# EAGLE design LED Strips - Schematic (EAGLE 6.5.0)
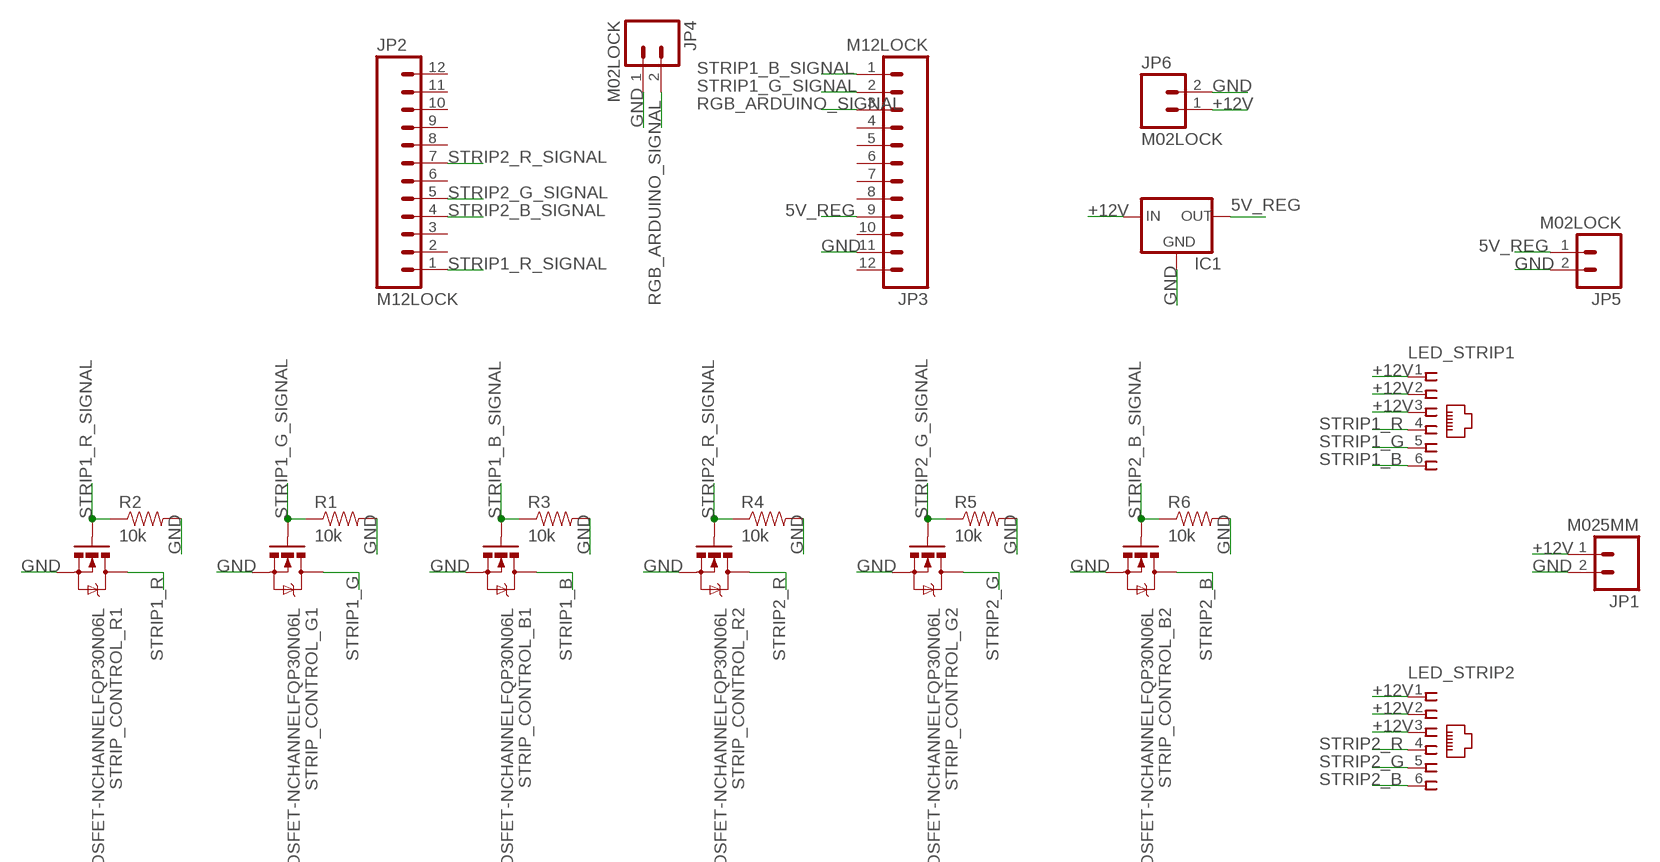
[diagram p0: schematic, sheet 1]

## Parts
IC1  V_REG_78XXSIDE  [78XXL]
JP1  M025MM  [SCREWTERMINAL-5MM-2]
JP2  M12LOCK  [1X12_LOCK]
JP3  M12LOCK  [1X12_LOCK]
JP4  M02LOCK  [1X02_LOCK]
JP5  M02LOCK  [1X02_LOCK]
JP6  M02LOCK  [1X02_LOCK]
LED_STRIP1  555165-1  [555165-1]
LED_STRIP2  555165-1  [555165-1]
R1  10k  RESISTOR0603  [0603-RES]
R2  10k  RESISTOR0603  [0603-RES]
R3  10k  RESISTOR0603  [0603-RES]
R4  10k  RESISTOR0603  [0603-RES]
R5  10k  RESISTOR0603  [0603-RES]
R6  10k  RESISTOR0603  [0603-RES]
STRIP_CONTROL_B1  MOSFET-NCHANNELFQP30N06L  [TO220V]
STRIP_CONTROL_B2  MOSFET-NCHANNELFQP30N06L  [TO220V]
STRIP_CONTROL_G1  MOSFET-NCHANNELFQP30N06L  [TO220V]
STRIP_CONTROL_G2  MOSFET-NCHANNELFQP30N06L  [TO220V]
STRIP_CONTROL_R1  MOSFET-NCHANNELFQP30N06L  [TO220V]
STRIP_CONTROL_R2  MOSFET-NCHANNELFQP30N06L  [TO220V]

## Nets
5V_REG: IC1.OUT JP3.9 JP5.1
+12V: IC1.IN JP1.1 JP6.1 LED_STRIP1.1 LED_STRIP1.2 LED_STRIP1.3 LED_STRIP2.1 LED_STRIP2.2 LED_STRIP2.3
GND: IC1.GND JP1.2 JP3.11 JP4.1 JP5.2 JP6.2 R1.2 R2.2 R3.2 R4.2 R5.2 R6.2 STRIP_CONTROL_B1.3(S) STRIP_CONTROL_B2.3(S) STRIP_CONTROL_G1.3(S) STRIP_CONTROL_G2.3(S) STRIP_CONTROL_R1.3(S) STRIP_CONTROL_R2.3(S)
RGB_ARDUINO_SIGNAL: JP3.3 JP4.2
STRIP1_B: LED_STRIP1.6 STRIP_CONTROL_B1.2(D)
STRIP1_B_SIGNAL: JP3.1 R3.1 STRIP_CONTROL_B1.1(G)
STRIP1_G: LED_STRIP1.5 STRIP_CONTROL_G1.2(D)
STRIP1_G_SIGNAL: JP3.2 R1.1 STRIP_CONTROL_G1.1(G)
STRIP1_R: LED_STRIP1.4 STRIP_CONTROL_R1.2(D)
STRIP1_R_SIGNAL: JP2.1 R2.1 STRIP_CONTROL_R1.1(G)
STRIP2_B: LED_STRIP2.6 STRIP_CONTROL_B2.2(D)
STRIP2_B_SIGNAL: JP2.4 R6.1 STRIP_CONTROL_B2.1(G)
STRIP2_G: LED_STRIP2.5 STRIP_CONTROL_G2.2(D)
STRIP2_G_SIGNAL: JP2.5 R5.1 STRIP_CONTROL_G2.1(G)
STRIP2_R: LED_STRIP2.4 STRIP_CONTROL_R2.2(D)
STRIP2_R_SIGNAL: JP2.7 R4.1 STRIP_CONTROL_R2.1(G)
Unconnected: JP2.2 JP2.3 JP2.6 JP2.8 JP2.9 JP2.10 JP2.11 JP2.12 JP3.4 JP3.5 JP3.6 JP3.7 JP3.8 JP3.10 JP3.12

## Library data of the parts
IC1 = SparkFun-PowerIC:V_REG_78XX: Voltage Regulator Standard 7805 5V regulator. IGO (Input Ground Output). Spark Fun Electronics SKU : COM-00107
JP1 JP4-JP6 = SparkFun-Connectors:M02: Standard 2-pin 0.1" header. Use with - straight break away headers ( PRT-00116) - right angle break away headers (PRT-00553) - swiss pins (PRT-00743) - machine pins (PRT-00117) - female headers (PRT-00115) Molex polarized connector foot print use with: PRT-08233 with associated crimp pins and housings. 2.54_SCREWTERM for use with PRT-10571. 3.5mm Screw Terminal footprints for PRT-08084 5mm Screw Terminal footprints for use with PRT-08433
JP2 JP3 = SparkFun-Connectors:M12: Header 12 Standard 12-pin 0.1" header. Use with straight break away headers (SKU : PRT-00116), right angle break away headers (PRT-00553), swiss pins (PRT-00743), machine pins (PRT-00117), and female headers (PRT-00115).
LED_STRIP1 LED_STRIP2 = con-amp:555165-1: AMP connector
R1-R6 = SparkFun-Resistors:RESISTOR: Resistor Basic schematic elements and footprints for 0603, 1206, and PTH resistors.
STRIP_CONTROL_B1 STRIP_CONTROL_B2 STRIP_CONTROL_G1 STRIP_CONTROL_G2 STRIP_CONTROL_R1 STRIP_CONTROL_R2 = SparkFun-DiscreteSemi:MOSFET-NCHANNEL: Common NMOSFET Parts MFG P/N Store ID Prod ID FDD8780 TRANS-09984 SI7820DN TRANS-11055 FDS6630A IC-08089 2N7002PW TRANS-11151 FQP30N06L COM-10213 TRANS-10060 BSS123LT1G TRANS-08345 BSS138 TRANS-00830 BS170 2N7000; PROD_ID: TRANS-10060

## Board
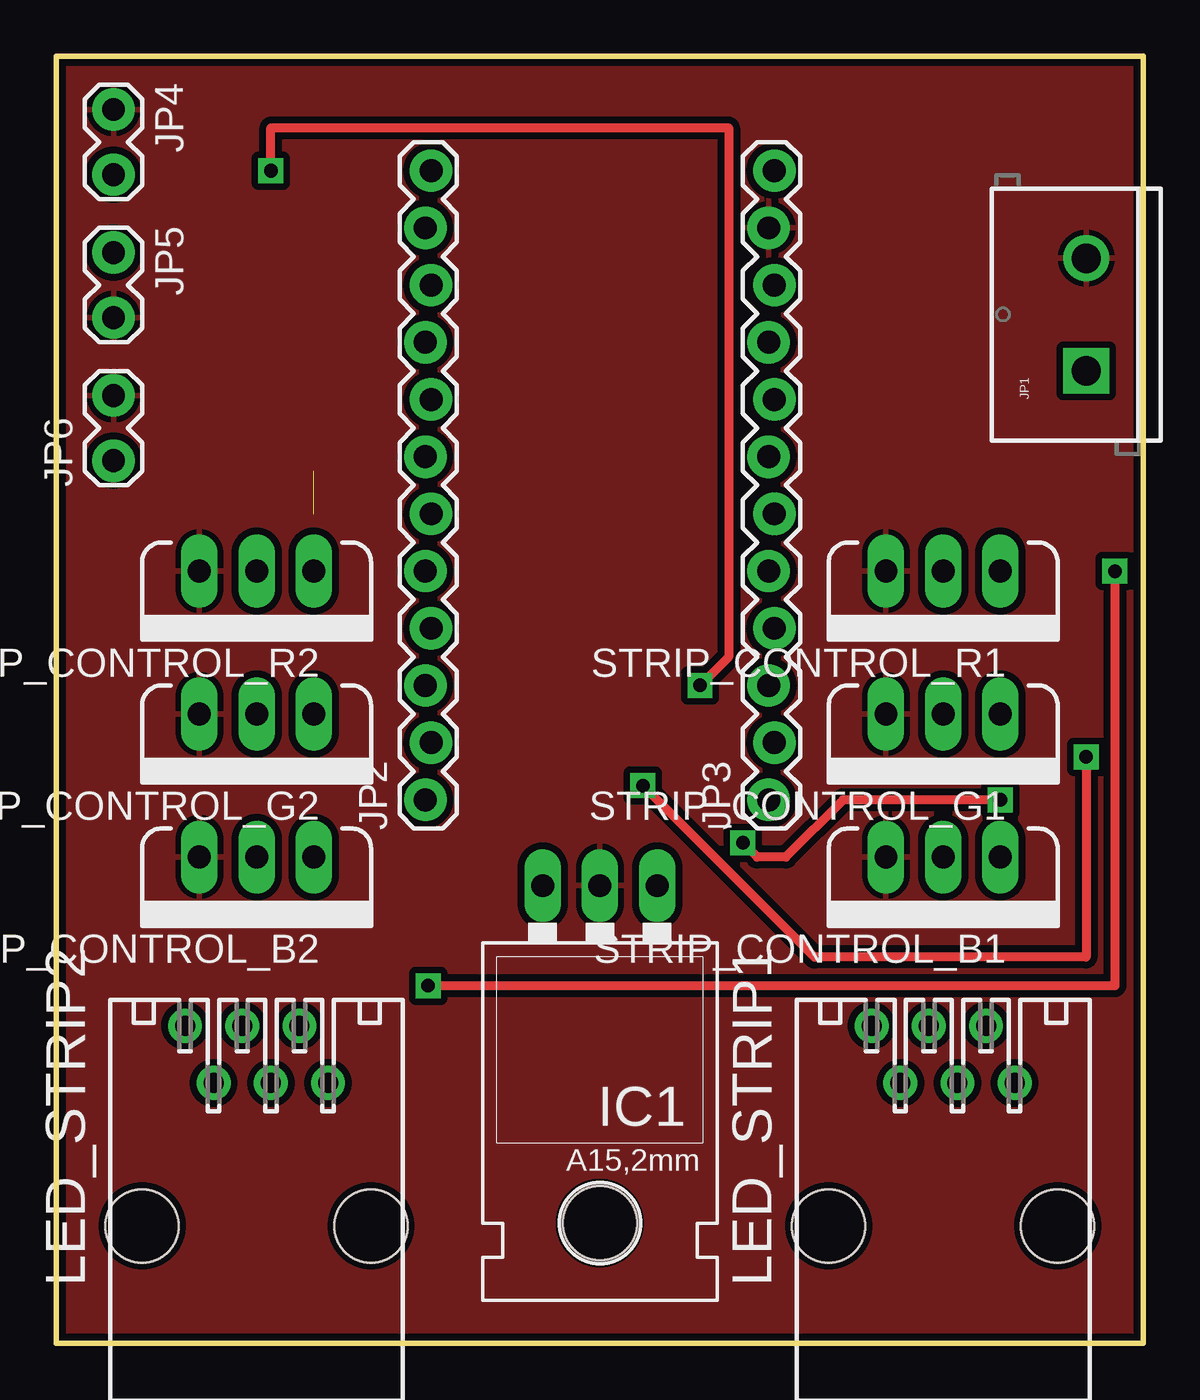
[diagram p1: board, top side]
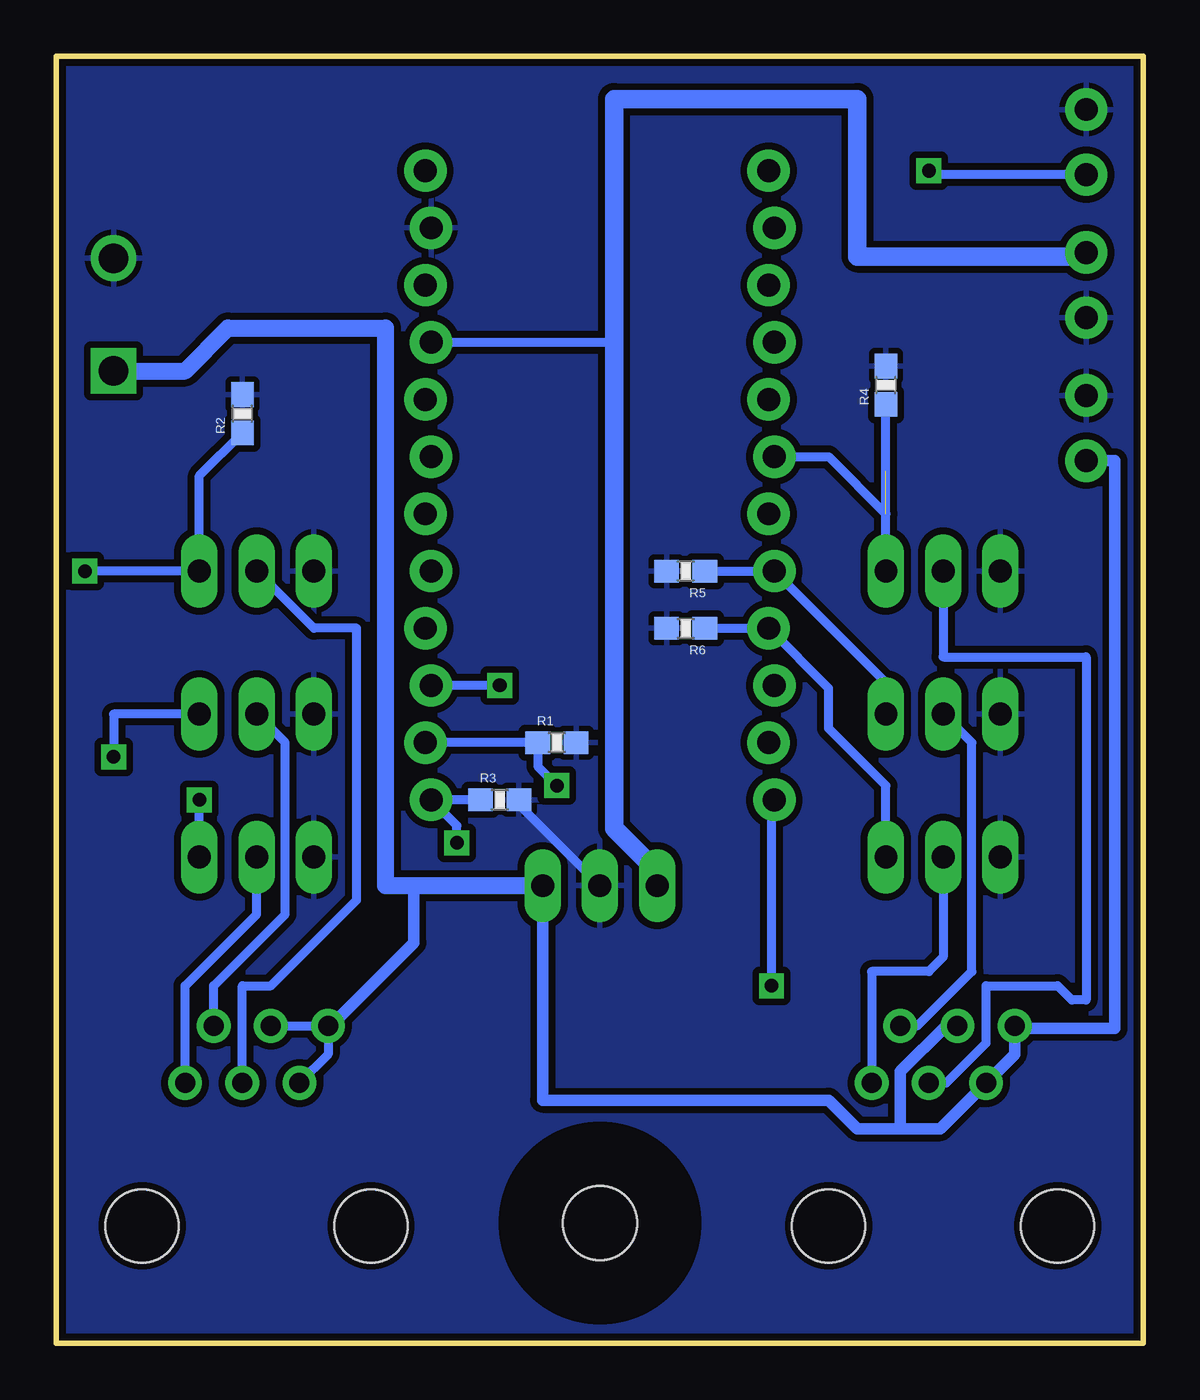
[diagram p2: board, bottom side, seen from below]

Size 48.26 x 57.15 mm. Coordinates in mm from the lower left corner, seen from the top.
Outline: 0,0 0,57.15 48.26,57.15 48.26,0 0,0
Copper layers (1*16): Top 0.035mm / dielectric 1.5mm / Bottom 0.035mm
Design rules "SparkFun": minimum track width 8mil, minimum drill 20mil, track to track 8mil, track to pad 8mil, pad to pad 8mil, via to via 8mil, smd to smd 8mil, copper to edge 8mil, drill to drill 8mil, minimum pad ring 12mil, minimum via ring 10mil, stop-mask expansion 4mil, vias tented up to drill 20mil, thermal gap 10mil

### Footprints (pad centres in the part's own frame; a part is rotated, then mirrored left to right if it is on the bottom)
78XXL = drill 1.016 long: GND 0,-3.81; IN -2.54,-3.81; OUT 2.54,-3.81 | hole 3.302: 0,11.176
SCREWTERMINAL-5MM-2 = drill 1.3 pad 2.032 square: 1 0,0 | drill 1.3 pad 2.032: 2 5,0
1X12_LOCK = drill 1.016 pad 1.88: 1 0,0.127; 2 2.54,-0.127; 3 5.08,0.127; 4 7.62,-0.127; 5 10.16,0.127; 6 12.7,-0.127; 7 15.24,0.127; 8 17.78,-0.127; 9 20.32,0.127; 10 22.86,-0.127; 11 25.4,0.127; 12 27.94,-0.127
1X02_LOCK = drill 1.016 pad 1.88: 1 -0.178,0; 2 2.718,0
555165-1 = drill 0.889: 1 -3.175,7.747; 2 -1.905,5.207; 3 -0.635,7.747; 4 0.635,5.207; 5 1.905,7.747; 6 3.175,5.207 | hole 3.251: -5.08,-1.143; 5.08,-1.143
0603-RES = smd 1.1 x 1: 1 -0.85,0; 2 0.85,0
TO220V = drill 1.016 long: 1 -2.54,0; 2 0,0; 3 2.54,0

### Placement (x,y rotation side)
IC1  24.13,16.51 180 top
JP1  45.72,43.18 90 top
JP2  16.51,24.13 90 top
JP3  31.75,24.13 90 top
JP4  2.54,54.61 270 top
JP5  2.54,48.26 270 top
JP6  2.54,39.37 90 top
LED_STRIP1  39.37,6.35 0 top
LED_STRIP2  8.89,6.35 0 top
R1  26.04,26.67 0 bottom
R2  40.01,41.27 90 bottom
R3  28.57,24.13 0 bottom
R4  11.43,42.55 90 bottom
R5  20.32,34.29 180 bottom
R6  20.32,31.75 180 bottom
STRIP_CONTROL_B1  39.37,21.59 180 top
STRIP_CONTROL_B2  8.89,21.59 180 top
STRIP_CONTROL_G1  39.37,27.94 180 top
STRIP_CONTROL_G2  8.89,27.94 180 top
STRIP_CONTROL_R1  39.37,34.29 180 top
STRIP_CONTROL_R2  8.89,34.29 180 top

### Tracks (layer width: path | path; a pad name or v marks a point on that pad's centre or on a via)
5V_REG
  Bottom 0.406: JP3.9 23.5,44.45
  Bottom 0.813: IC1.OUT 21.59,20.95 23.5,22.86 23.5,44.45 23.5,55.24 12.7,55.24 12.7,48.26 2.72,48.26 JP5.1
+12V
  Bottom 0.406: LED_STRIP1.2 36.2,12.83 LED_STRIP1.1 LED_STRIP1.3
  Bottom 0.508: JP6.1 1.27,39.19 1.27,13.97 5.71,13.97 LED_STRIP2.1 5.71,12.83 LED_STRIP2.2 9.02,9.53 10.79,9.53 | LED_STRIP1.1 36.07,14.1 32.38,17.78 32.38,20.32 | IC1.IN 26.67,10.79 13.97,10.79 12.7,9.53 10.79,9.53 | LED_STRIP2.3 8.76,14.1 10.79,12.06 10.79,9.53
  Bottom 0.762: JP1.1 42.55,43.18 40.64,45.09 33.66,45.09 33.66,20.32 32.38,20.32 IC1.IN
GND
  Bottom 0.406: R3.2 27.73,23.91 IC1.GND
  pour Top (isolate 0.305): 0,0 0,57.15 48.26,57.15 48.26,0
  pour Bottom (isolate 0.305): 0,0 0,57.15 48.26,57.15 48.26,0
RGB_ARDUINO_SIGNAL  (via drill 0.6)
  Top 0.406: v9.53,52.07 9.53,53.98 29.84,53.98 29.84,30.48 v28.57,29.21
  Bottom 0.406: JP4.2 9.35,51.89 v9.53,52.07 | v28.57,29.21 JP3.3
STRIP1_B
  Bottom 0.406: LED_STRIP1.6 42.55,15.88 39.37,19.05 STRIP_CONTROL_B1.2
STRIP1_B_SIGNAL  (via drill 0.6)
  Top 0.406: v41.91,24.13 34.92,24.13 32.38,21.59 31.11,21.59 v30.48,22.23
  Bottom 0.406: STRIP_CONTROL_B1.1 v41.91,24.13 | v30.48,22.23 30.48,22.99 JP3.1 R3.1
STRIP1_G
  Bottom 0.406: LED_STRIP1.5 41.27,15.88 38.1,19.05 38.1,26.67 STRIP_CONTROL_G1.2
STRIP1_G_SIGNAL  (via drill 0.6)
  Top 0.406: v45.72,26.04 45.72,17.14 33.66,17.14 v26.04,24.77
  Bottom 0.406: JP3.2 R1.1 26.89,25.61 v26.04,24.77 | STRIP_CONTROL_G1.1 45.72,27.94 v45.72,26.04
STRIP1_R
  Bottom 0.406: LED_STRIP1.4 40.01,15.88 38.73,15.88 34.92,19.68 34.92,31.75 36.83,31.75 STRIP_CONTROL_R1.2
STRIP1_R_SIGNAL  (via drill 0.6)
  Top 0.406: v46.99,34.29 46.99,15.88 v16.51,15.88
  Bottom 0.406: v46.99,34.29 STRIP_CONTROL_R1.1 41.91,38.52 R2.1 | v16.51,15.88 16.51,24 JP2.1
STRIP2_B
  Bottom 0.406: STRIP_CONTROL_B2.2 8.89,17.14 9.53,16.51 12.06,16.51 LED_STRIP2.6
STRIP2_B_SIGNAL
  Bottom 0.406: STRIP_CONTROL_B2.1 11.43,24.77 13.97,27.3 13.97,29.08 JP2.4 R6.1
STRIP2_G
  Bottom 0.406: LED_STRIP2.5 10.03,14.1 7.62,16.51 7.62,26.67 STRIP_CONTROL_G2.2
STRIP2_G_SIGNAL
  Bottom 0.406: STRIP_CONTROL_G2.1 11.43,29.34 JP2.5 R5.1
STRIP2_R
  Bottom 0.406: STRIP_CONTROL_R2.2 8.89,30.48 2.54,30.48 2.54,15.24 3.17,15.24 3.81,15.88 6.99,15.88 6.99,13.34 8.76,11.56 LED_STRIP2.4
STRIP2_R_SIGNAL  (2 unrouted)
  Bottom 0.406: STRIP_CONTROL_R2.1 11.43,36.83 | JP2.7 13.97,39.37 11.43,36.83 | 11.43,36.83 R4.1